# Altium schematic sheet Power_Distribution.SchDoc
size A4; SheetNumber: 10; SheetTotal: 11
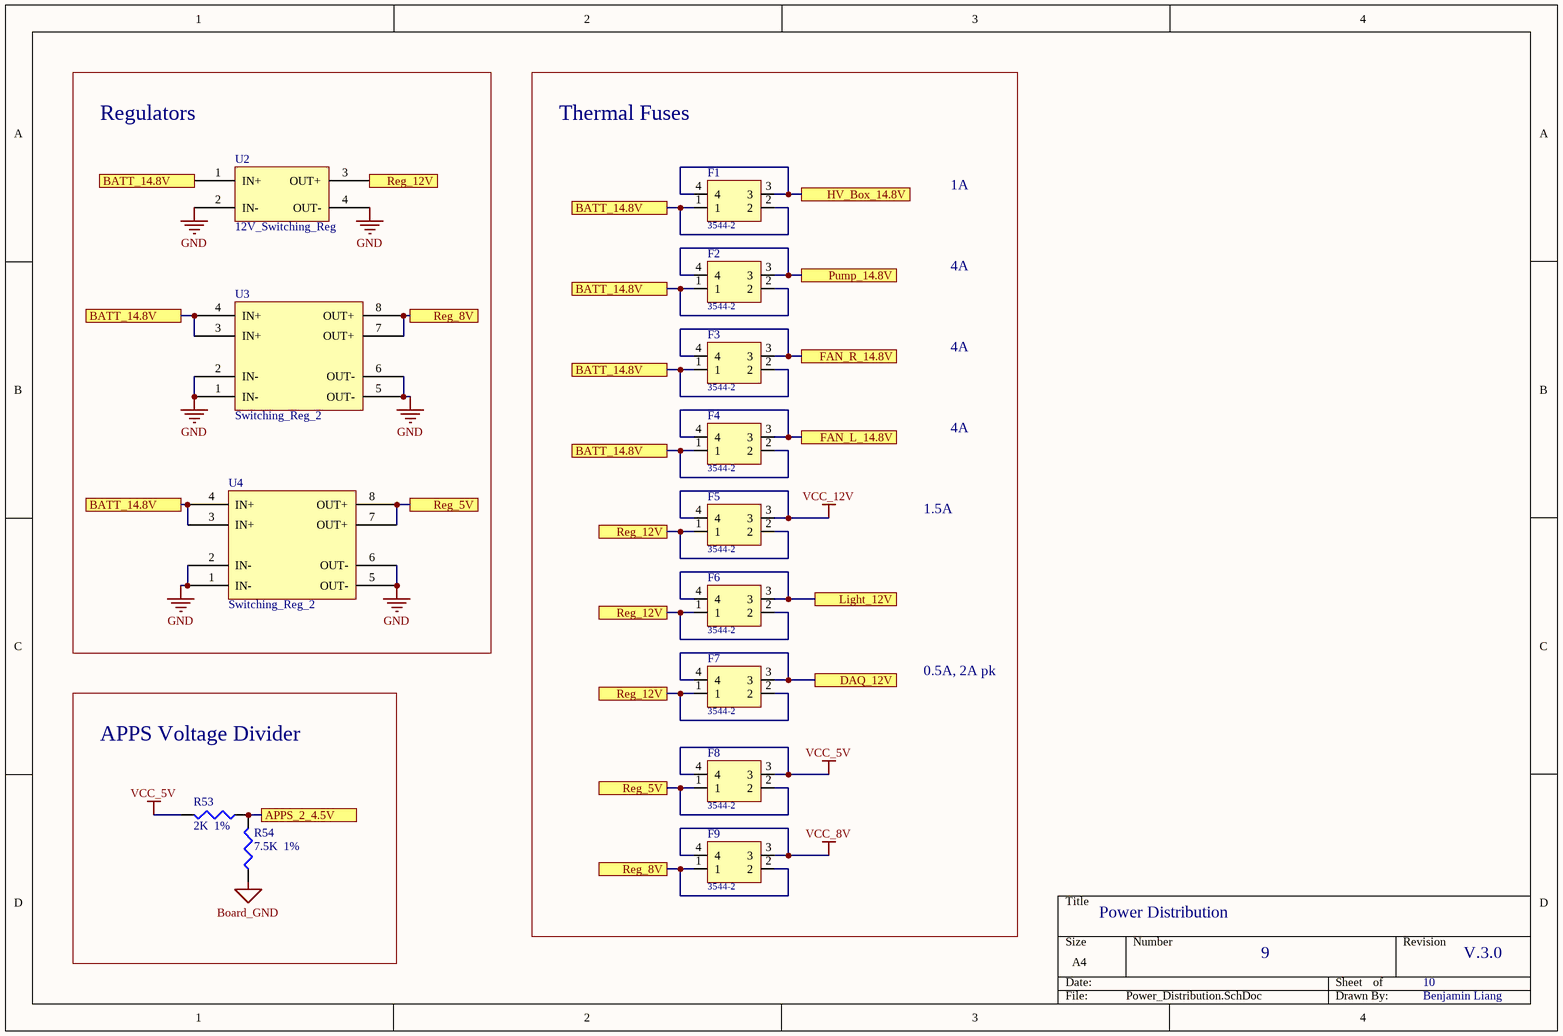
[diagram p0: Power_Distribution.SchDoc]

## Parts
F1  3544-2  [3544-2]
F2  3544-2  [3544-2]
F3  3544-2  [3544-2]
F4  3544-2  [3544-2]
F5  3544-2  [3544-2]
F6  3544-2  [3544-2]
F7  3544-2  [3544-2]
F8  3544-2  [3544-2]
F9  3544-2  [3544-2]
R53  2K  1%  [J1-0603]
R54  7.5K  1%  [J1-0603]
U2  12V_Switching_Reg  [PCBComponent_1 - duplicate]
U3  Switching_Reg_2  [PCBComponent_1]
U4  Switching_Reg_2  [PCBComponent_1]

## Blocks framed on the sheet
Regulators: U2-U4
Thermal Fuses: F1-F9
APPS Voltage Divider: R53 R54

## Ports
APPS_2_4.5V, BATT_14.8V, DAQ_12V, FAN_L_14.8V, FAN_R_14.8V, HV_Box_14.8V, Light_12V, Pump_14.8V, Reg_5V, Reg_8V, Reg_12V

## Nets
Board_GND: R54.1
GND: U2.2(IN-) U2.4(OUT-) U3.1(IN-) U3.2(IN-) U3.5(OUT-) U3.6(OUT-) U4.1(IN-) U4.2(IN-) U4.5(OUT-) U4.6(OUT-)
VCC_5V: F8.3 F8.4 R53.2
VCC_8V: F9.3 F9.4
VCC_12V: F5.3 F5.4
APPS_2_4.5V: R53.1 R54.2 ; port APPS_2_4.5V
BATT_14.8V: F1.1 F1.2 F2.1 F2.2 F3.1 F3.2 F4.1 F4.2 U2.1(IN+) U3.3(IN+) U3.4(IN+) U4.3(IN+) U4.4(IN+) ; port BATT_14.8V
DAQ_12V: F7.3 F7.4 ; port DAQ_12V
FAN_L_14.8V: F4.3 F4.4 ; port FAN_L_14.8V
FAN_R_14.8V: F3.3 F3.4 ; port FAN_R_14.8V
HV_Box_14.8V: F1.3 F1.4 ; port HV_Box_14.8V
Light_12V: F6.3 F6.4 ; port Light_12V
Pump_14.8V: F2.3 F2.4 ; port Pump_14.8V
Reg_5V: F8.1 F8.2 U4.7(OUT+) U4.8(OUT+) ; port Reg_5V
Reg_8V: F9.1 F9.2 U3.7(OUT+) U3.8(OUT+) ; port Reg_8V
Reg_12V: F5.1 F5.2 F6.1 F6.2 F7.1 F7.2 U2.3(OUT+) ; port Reg_12V

## Notes on the sheet
- 1A
- 4A
- 1.5A
- 0.5A, 2A pk
- Power Distribution
- 9
- 10
- V.3.0
- Benjamin Liang

## Library data of the parts
F1-F9 = Component_1
R53 R54 = Res3: Resistor; Value: 220; Published: 8-Jun-2000; LatestRevisionDate: 29-May-2009; LatestRevisionNote: IPC-7351 Footprint Added.; PackageReference: J1-0603; Publisher: Altium Limited; PackageDescription: Chip Resistor
U2 = Switching_Reg